# Altium project Power-second_Ver0.1.PrjPcb
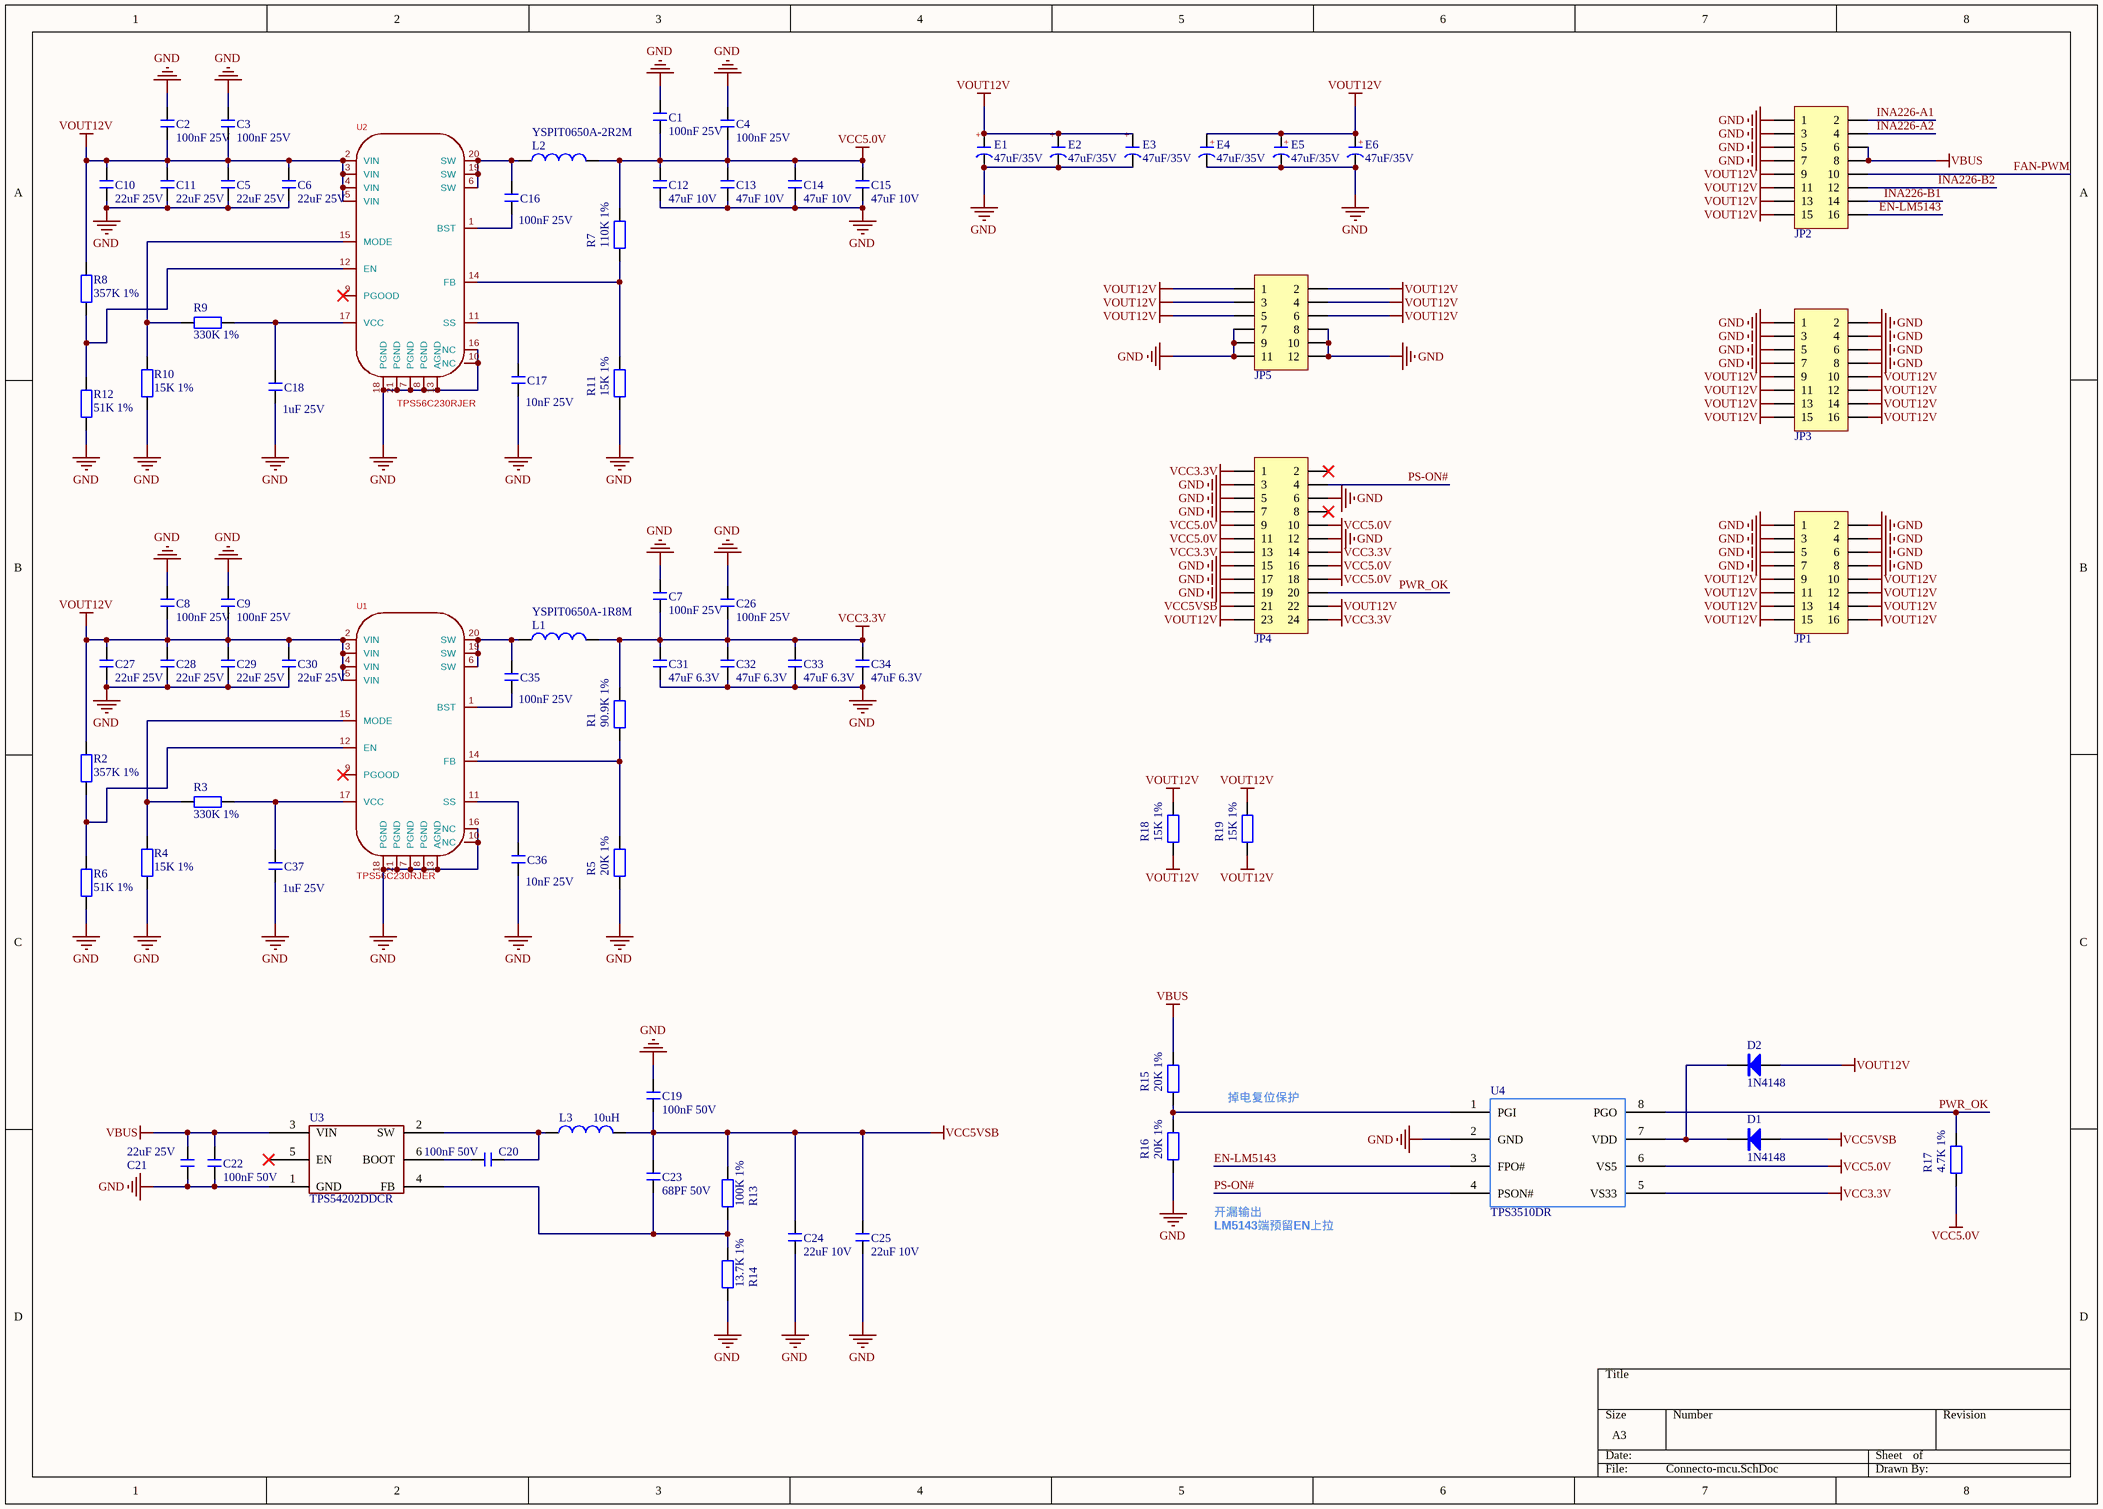
[diagram p0: Connecto-mcu.SchDoc]
1 sheet, 76 parts. Net scope: global (net labels, ports and power ports of the same name join across sheets).
Board file: Power-second_Ver0.1.PcbDoc

## Sheet Connecto-mcu.SchDoc
size A3; SheetNumber: 1; SheetTotal: 1

### Parts
C1  100nF 25V  [C0805_L]
C2  100nF 25V  [C0402_L]
C3  100nF 25V  [C0402_L]
C4  100nF 25V  [C0805_L]
C5  22uF 25V  [C0805_L]
C6  22uF 25V  [C0805_L]
C7  100nF 25V  [C0805_L]
C8  100nF 25V  [C0402_L]
C9  100nF 25V  [C0402_L]
C10  22uF 25V  [C0805_L]
C11  22uF 25V  [C0805_L]
C12  47uF 10V  [C0805_L]
C13  47uF 10V  [C0805_L]
C14  47uF 10V  [C0805_L]
C15  47uF 10V  [C0805_L]
C16  100nF 25V  [C0402_L]
C17  10nF 25V  [C0402_L]
C18  1uF 25V  [C0402_L]
C19  100nF 50V  [C0402_L]
C20  100nF 50V  [C0402_L]
C21  22uF 25V  [C0805_L]
C22  100nF 50V  [C0402_L]
C23  68PF 50V  [C0402_L]
C24  22uF 10V  [C0805_L]
C25  22uF 10V  [C0805_L]
C26  100nF 25V  [C0805_L]
C27  22uF 25V  [C0805_L]
C28  22uF 25V  [C0805_L]
C29  22uF 25V  [C0805_L]
C30  22uF 25V  [C0805_L]
C31  47uF 6.3V  [C0805_L]
C32  47uF 6.3V  [C0805_L]
C33  47uF 6.3V  [C0805_L]
C34  47uF 6.3V  [C0805_L]
C35  100nF 25V  [C0402_L]
C36  10nF 25V  [C0402_L]
C37  1uF 25V  [C0402_L]
D1  1N4148  [SOD-523_L1.2-W0.8-LS1.6-FD]
D2  1N4148  [SOD-523_L1.2-W0.8-LS1.6-FD]
E1  47uF/35V  [CT 6*6 - V -A]
E2  47uF/35V  [CT 6*6 - V -A]
E3  47uF/35V  [CT 6*6 - V -A]
E4  47uF/35V  [CT 6*6 - V -A]
E5  47uF/35V  [CT 6*6 - V -A]
E6  47uF/35V  [CT 6*6 - V -A]
JP1  Header 8X2  [HDR2.54-LI-2x8P]  (value not drawn)
JP2  Header 8X2  [HDR2.54-LI-2x8P]  (value not drawn)
JP3  Header 8X2  [HDR2.54-LI-2x8P]  (value not drawn)
JP4  Header 2X11  [MX3.0 2X12 Pin 卧贴]  (value not drawn)
JP5  Header 6X2  [MX3.0 2X6 Pin 卧贴]  (value not drawn)
L1  YSPIT0650A-1R8M  [NR6045]
L2  YSPIT0650A-2R2M  [NR6045]
L3  10uH  [SMMS0420]
R1  90.9K 1%  [R0402_L]
R2  357K 1%  [R0402_L]
R3  330K 1%  [R0402_L]
R4  15K 1%  [R0402_L]
R5  20K 1%  [R0402_L]
R6  51K 1%  [R0402_L]
R7  110K 1%  [R0402_L]
R8  357K 1%  [R0402_L]
R9  330K 1%  [R0402_L]
R10  15K 1%  [R0402_L]
R11  15K 1%  [R0402_L]
R12  51K 1%  [R0402_L]
R13  100K 1%  [R0402_L]
R14  13.7K 1%  [R0402_L]
R15  20K 1%  [R0402_L]
R16  20K 1%  [R0402_L]
R17  4.7K 1%  [R0402_L]
R18  15K 1%  [内嵌载流铜条 2x2x66.5mm]
R19  15K 1%  [内嵌载流铜条 2x2x66.5mm]
U1  TPS56C230RJER  [VQFN-20_L3.0-W3.0-P0.45-TL-EP_TI_RJE]
U2  TPS56C230RJER  [VQFN-20_L3.0-W3.0-P0.45-TL-EP_TI_RJE]
U3  TPS54202DDCR  [SOT23-6L]
U4  TPS3510DR  [SOP8_N]

### Nets
GND: C1.2 C2.2 C3.2 C4.2 C5.1 C6.1 C7.2 C8.2 C9.2 C10.1 C11.1 C12.1 C13.1 C14.1 C15.1 C17.1 C18.1 C19.2 C21.1 C22.1 C24.2 C25.2 C26.2 C27.1 C28.1 C29.1 C30.1 C31.1 C32.1 C33.1 C34.1 C36.1 C37.1 E1.2(K) E2.2(K) E3.2(K) E4.2(K) E5.2(K) E6.2(K) JP1.1 JP1.2 JP1.3 JP1.4 JP1.5 JP1.6 JP1.7 JP1.8 JP2.1 JP2.3 JP2.5 JP2.7 JP3.1 JP3.2 JP3.3 JP3.4 JP3.5 JP3.6 JP3.7 JP3.8 JP4.3 JP4.5 JP4.6 JP4.7 JP4.12 JP4.15 JP4.17 JP4.19 JP5.7 JP5.8 JP5.9 JP5.10 JP5.11 JP5.12 R4.1 R5.2 R6.1 R10.1 R11.2 R12.1 R14.2 R16.2 U1.7(PGND) U1.8(PGND) U1.10(NC) U1.13(AGND) U1.16(NC) U1.18(PGND) U1.21(PGND) U2.7(PGND) U2.8(PGND) U2.10(NC) U2.13(AGND) U2.16(NC) U2.18(PGND) U2.21(PGND) U3.1(GND) U4.2(GND)
VBUS: C21.2 C22.2 JP2.6 JP2.8 R15.1 U3.3(VIN)
VCC3.3V: C7.1 C26.1 C31.2 C32.2 C33.2 C34.2 JP4.1 JP4.13 JP4.14 JP4.24 L1.2 R1.1 U4.5(VS33)
VCC5.0V: C1.1 C4.1 C12.2 C13.2 C14.2 C15.2 JP4.9 JP4.10 JP4.11 JP4.16 JP4.18 L2.2 R7.1 R17.2 U4.6(VS5)
VCC5VSB: C19.1 C23.2 C24.1 C25.1 D1.1(A) JP4.21 L3.2 R13.1
VOUT12V: C2.1 C3.1 C5.2 C6.2 C8.1 C9.1 C10.2 C11.2 C27.2 C28.2 C29.2 C30.2 D2.1(A) E1.1(A) E2.1(A) E3.1(A) E4.1(A) E5.1(A) E6.1(A) JP1.9 JP1.10 JP1.11 JP1.12 JP1.13 JP1.14 JP1.15 JP1.16 JP2.9 JP2.11 JP2.13 JP2.15 JP3.9 JP3.10 JP3.11 JP3.12 JP3.13 JP3.14 JP3.15 JP3.16 JP4.22 JP4.23 JP5.1 JP5.2 JP5.3 JP5.4 JP5.5 JP5.6 R2.2 R8.2 R18.1 R18.2 R19.1 R19.2 U1.2(VIN) U1.3(VIN) U1.4(VIN) U1.5(VIN) U2.2(VIN) U2.3(VIN) U2.4(VIN) U2.5(VIN)
EN-LM5143: JP2.16 U4.3(FPO#)
FAN-PWM: JP2.10
INA226-A1: JP2.2
INA226-A2: JP2.4
INA226-B1: JP2.14
INA226-B2: JP2.12
PS-ON#: JP4.4 U4.4(PSON#)
PWR_OK: JP4.20 R17.1 U4.8(PGO)
NetC16_1: C16.1 U2.1(BST)
NetC16_2: C16.2 L2.1 U2.6(SW) U2.19(SW) U2.20(SW)
NetC17_2: C17.2 U2.11(SS)
NetC18_2: C18.2 R9.1 U2.17(VCC)
NetC20_1: C20.1 U3.6(BOOT)
NetC20_2: C20.2 L3.1 U3.2(SW)
NetC23_1: C23.1 R13.2 R14.1 U3.4(FB)
NetC35_1: C35.1 U1.1(BST)
NetC35_2: C35.2 L1.1 U1.6(SW) U1.19(SW) U1.20(SW)
NetC36_2: C36.2 U1.11(SS)
NetC37_2: C37.2 R3.1 U1.17(VCC)
NetD1_2: D1.2(K) D2.2(K) U4.7(VDD)
NetR1_2: R1.2 R5.1 U1.14(FB)
NetR2_1: R2.1 R6.2 U1.12(EN)
NetR3_2: R3.2 R4.2 U1.15(MODE)
NetR7_2: R7.2 R11.1 U2.14(FB)
NetR8_1: R8.1 R12.2 U2.12(EN)
NetR9_2: R9.2 R10.2 U2.15(MODE)
NetR15_2: R15.2 R16.1 U4.1(PGI)

Not connected (* = marked no-connect by the designer): JP4 2* 8*; U1 9(PGOOD)*; U2 9(PGOOD)*; U3 5(EN)*

### Notes on the sheet
- 掉电复位保护
- LM5143端预留EN上拉
- 开漏输出
- (in symbol C-CAP) +

### Library data of the parts
C1-C37 = C: 无极性贴片电容; 版权归属: 源创客; 材质: X7R; BOM名称: 无极性贴片电容; 学习资源: www.ooocke.com
D1 D2 = 1N4007: 整流二极管; 版权归属: 源创客; BOM名称: 整流二极管; 学习资源: www.ooocke.com
E1-E6 = C-CAP: 直插电解电容; 版权归属: 源创客; BOM名称: 直插电解电容; 学习资源: www.ooocke.com
JP1-JP3 = Header 8X2: 8*2P接插件; 版权归属: 源创客; BOM名称: 8*2P接插件; 学习资源: www.ooocke.com
JP4 = Header 12X2: 12*2P接插件; 版权归属: 源创客; BOM名称: 12*2P接插件; 学习资源: www.ooocke.com
JP5 = Header  6X2: 6*2P接插件; 版权归属: 源创客; BOM名称: 6*2P接插件; 学习资源: www.ooocke.com
L1-L3 = L: 小功率贴片电感; 版权归属: 源创客; BOM名称: 小功率贴片电感; 学习资源: www.ooocke.com
R1-R19 = R: 贴片电阻; 版权归属: 源创客; BOM名称: 贴片电阻; 学习资源: www.ooocke.com
U1 U2 = TPS56C230RJER: 功能类型:降压型;输出类型:可调;输入电压:4.5V~18V;输出电压:600mV~5.5V;输出电流(最大值):12A;; Manufacturer: TI(德州仪器); AddInBom: yes; Function: 降压型; Output Type: 可调; Output Current (Max): 12A; Switching Frequency: 500kHz; Synchronous Rectification: 是; Number of Outputs: 1; Topology: 降压式; Switch tube (built-in/external): 内置; ModelId: a0d54152b84047e092cea8f9e273e78e; ModelTransform: 118.8974,118.8974,0,0,0,0,0,0,0; Symbol: TPS56C230RJER; Device: TPS56C230RJER; Supplier: LCSC; SupplierPart: C1849534; ManufacturerPart: TPS56C230RJER; JLCPCB Part Class: 扩展库; LCSC Part Name: TPS56C230RJER; Supplier Footprint: VQFN-20-EP(3x3); Datasheet: https://www.ti.com/cn/lit/gpn/tps56c230; ConvertToPcb: yes; Input Voltage: 4.5V~18V; Output Voltage: 600mV~5.5V; Operating Temperature: -40℃~+125℃@(TJ); FootprintName: VQFN-20_L3.0-W3.0-P0.45-TL-EP_TI_RJE; ModelName: VQFN-20_L3.0-W3.0-P0.45-TL-EP_TI_RJE
U3 = TPS54202DDCR: DCDC Convert
U4 = TPS3510DR: TPS3510 适用于开关模式电源的 3 通道监控器